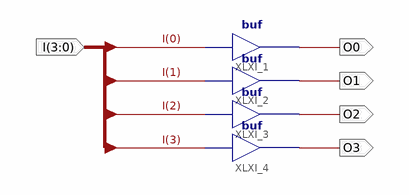
[diagram p0: schematic sheet 1]
// Xilinx ISE schematic btw4.sch (spartan6) as structural Verilog: 4 symbols, 5 ports
module btw4 (
  input  [3:0] I,
  output O0,
  output O1,
  output O2,
  output O3
);

  buf XLXI_1 (O0, I[0]);
  buf XLXI_2 (O1, I[1]);
  buf XLXI_3 (O2, I[2]);
  buf XLXI_4 (O3, I[3]);
endmodule
